# EAGLE design Spypow (EAGLE 5.11)
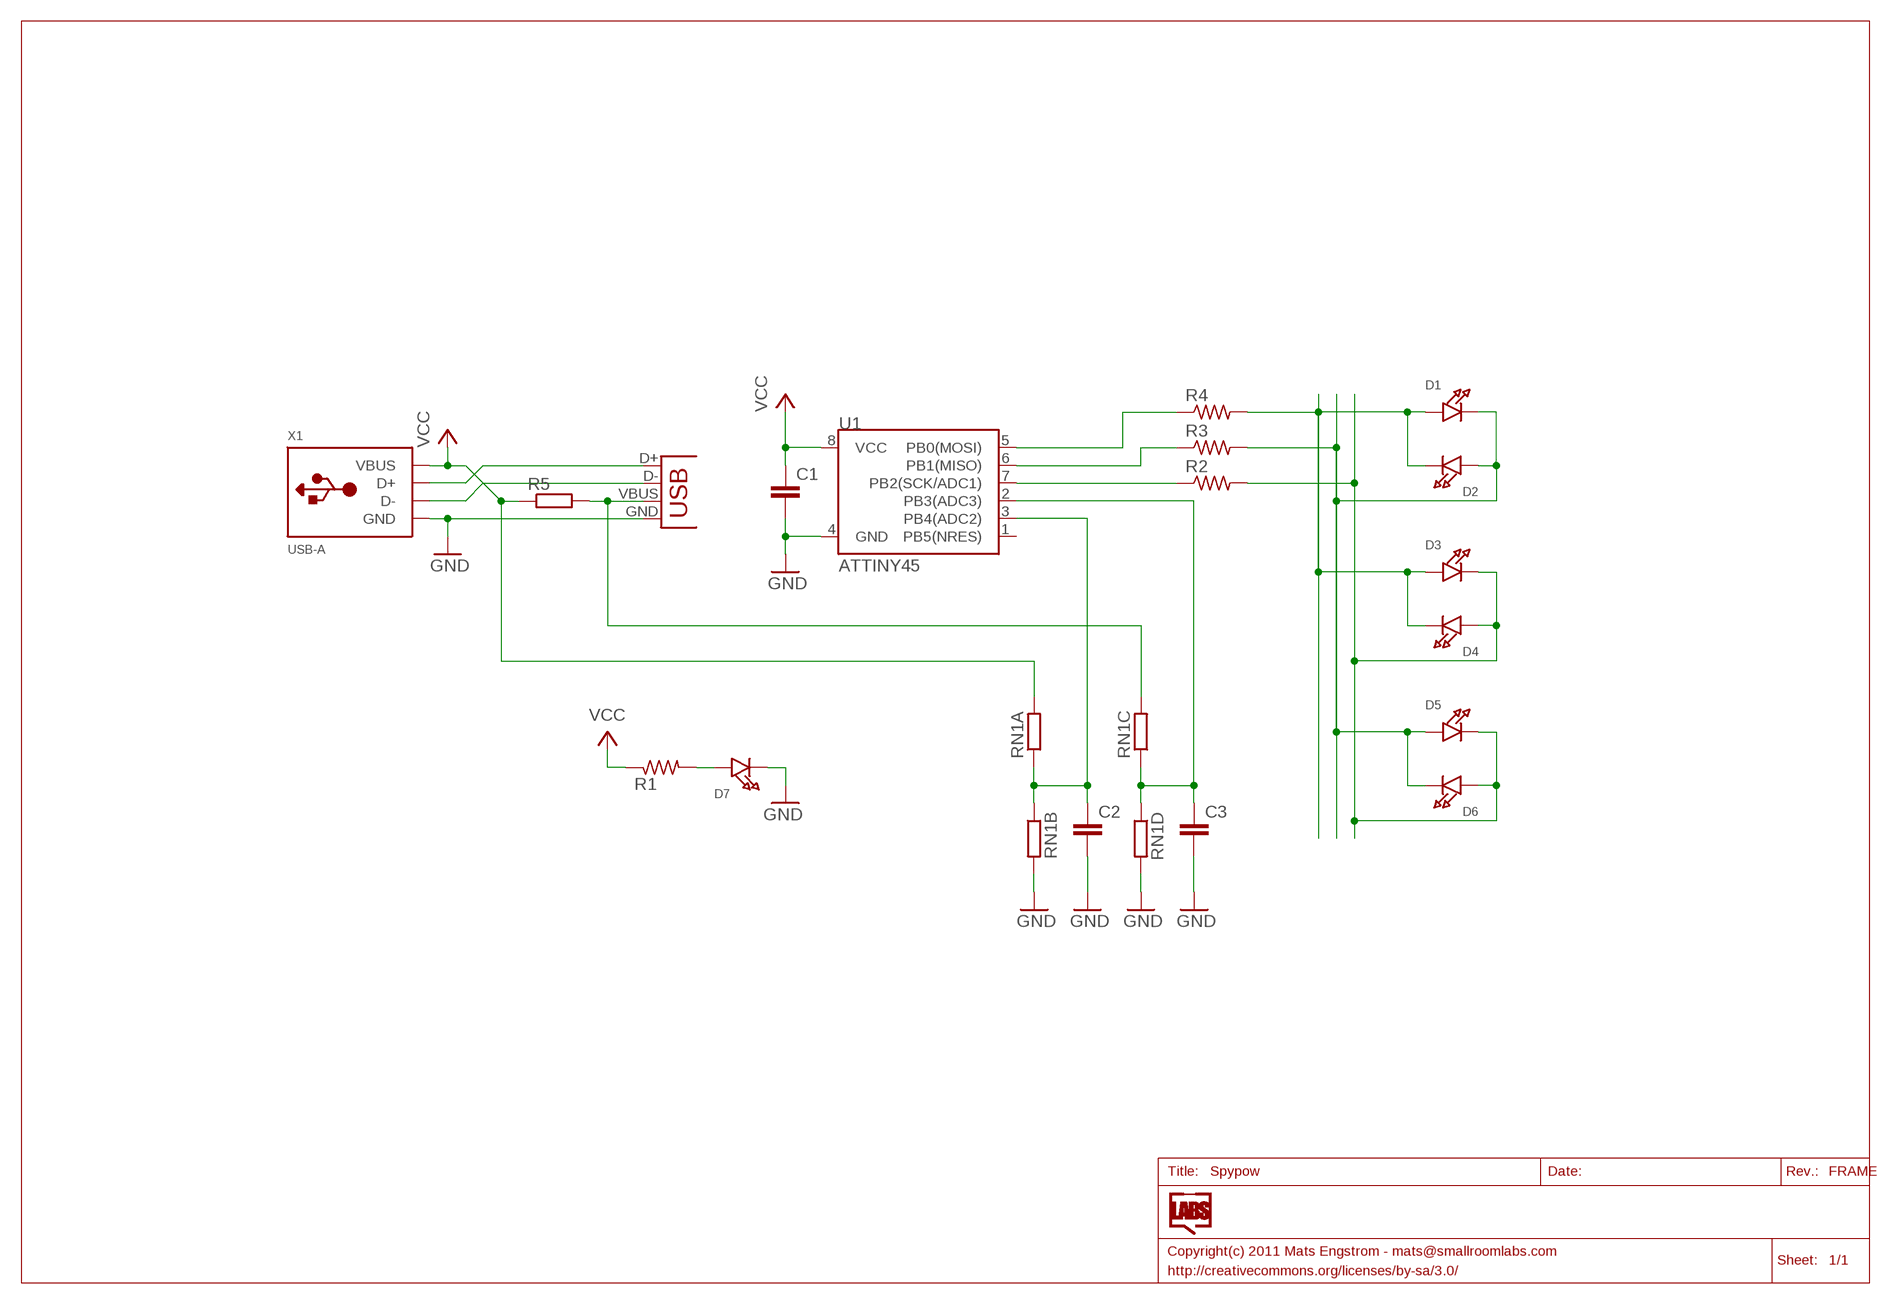
[diagram p0: schematic, sheet 1]

## Parts
C1  C-EUC0805K  [C0805K]
C2  C-EUC0805K  [C0805K]
C3  C-EUC0805K  [C0805K]
D1  LEDSMD0805  [CHIPLED_0805]
D2  LEDSMD0805  [CHIPLED_0805]
D3  LEDSMD0805  [CHIPLED_0805]
D4  LEDSMD0805  [CHIPLED_0805]
D5  LEDSMD0805  [CHIPLED_0805]
D6  LEDSMD0805  [CHIPLED_0805]
D7  LEDSMD0805  [CHIPLED_0805]
R1  RES0805A  [R0805A]
R2  RES0805A  [R0805A]
R3  RES0805A  [R0805A]
R4  RES0805A  [R0805A]
R5  R-EU_M1206  [M1206]
RN1  RESISTOR_ARRAY_4  [RN8P-4R-CRA06S]
U1  ATTINY45  [SO08-EIAJ]
X1  USB-A  [MOLEX_480371000]
X2  USBUSB-A-S-NOSILK  [USB-A-S-NOSILK]

## Nets
GND: C1.2 C2.2 C3.2 D7.C RN1.5 RN1.7 U1.4(GND) X1.4(GND) X2.GND
N$1: R5.2 RN1.6 X2.VBUS
N$2: R4.1 U1.5(PB0(MOSI))
N$3: X1.2(D-) X2.D-
N$4: X1.3(D+) X2.D+
N$5: D7.A R1.2
N$6: R3.1 U1.6(PB1(MISO))
N$7: R2.1 U1.7(PB2(SCK/ADC1))
N$9: D1.A D2.C D3.A D4.C R4.2
N$11: D1.C D2.A D5.A D6.C R3.2
N$12: D3.C D4.A D5.C D6.A R2.2
N$13: C2.1 RN1.1 RN1.2 U1.3(PB4(ADC2))
N$14: C3.1 RN1.3 RN1.4 U1.2(PB3(ADC3))
VCC: C1.1 R1.1 R5.1 RN1.8 U1.8(VCC) X1.1(VBUS)
Unconnected: U1.1(PB5(NRES))

## Library data of the parts
C1-C3 = rcl:C-EU: CAPACITOR, European symbol
D1-D7 = SmallRoomLabs:LED
R1-R4 = SmallRoomLabs:RES
R5 = rcl:R-EU_: RESISTOR, European symbol
RN1 = dp_devices:RESISTOR_ARRAY_4: 4 Resistor Array 0603
U1 = SparkFun:ATTINY45: Atmel ATTiny45
X1 = adafruit:USB-A: USB type A 'plug' Used for things that can directly connect to a USB port, say USB key
X2 = SparkFun:USB: USB Connectors USB-B-PTH is fully proven SKU : PRT-00139 USB-miniB is fully proven SKU : PRT-00587 USB-A-PCB is untested. USB-A-H is throughly reviewed, but untested. Spark Fun Electronics SKU : PRT-00437 USB-B-SMT is throughly reviewed, but untested. Needs silkscreen touching up. USB-A-S has not been used/tested USB-MB-H has not been used/tested

## Net classes
0 default: width 0.203 mm, drill 0.305 mm, clearance 0.203 mm

## Board
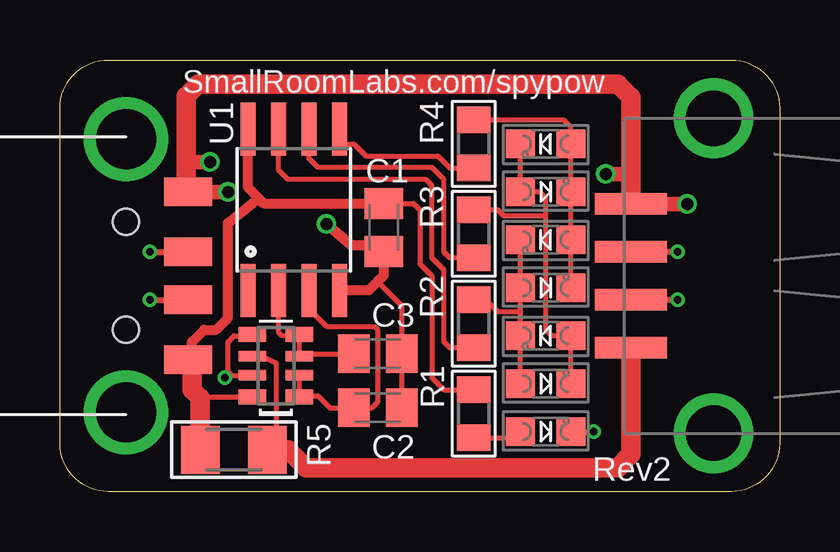
[diagram p1: board, top side]
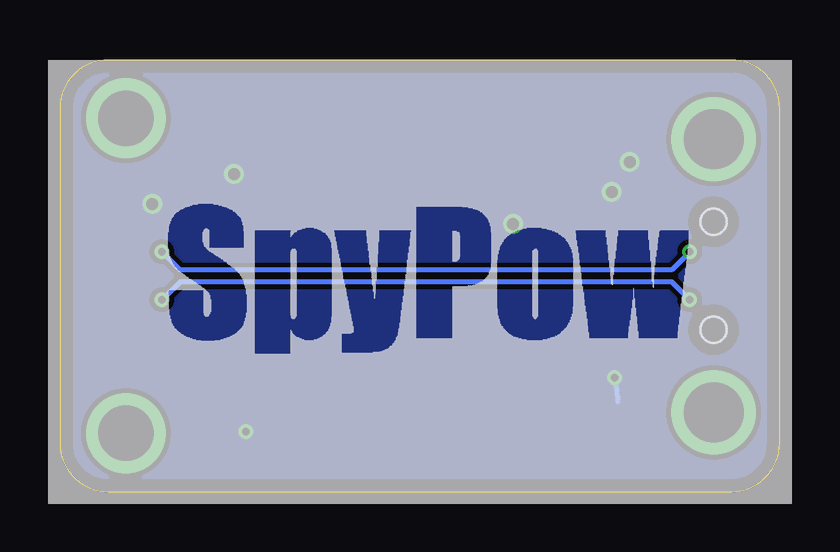
[diagram p2: board, bottom side, seen from below]

Size 30 x 18 mm. Coordinates in mm from the lower left corner, seen from the top.
Outline: 0,16 arc-90 2,18 28,18 arc-90 30,16 30,2 arc-90 28,0 2,0 arc-90 0,2 0,16
Copper layers (1*16): Top 0.035mm / dielectric 1.5mm / Bottom 0.035mm
Design rules "SmartPrototyping": minimum track width 7mil, minimum drill 12mil, track to track 7mil, track to pad 7mil, pad to pad 7mil, via to via 7mil, smd to smd 0mil, copper to edge 20mil, drill to drill 10mil, minimum pad ring 10mil, minimum via ring 6mil, stop-mask expansion 2mil, vias tented up to drill 25mil, thermal gap 10mil

### Footprints (pad centres in the part's own frame; a part is rotated, then mirrored left to right if it is on the bottom)
C0805K = smd 1.3 x 1.6: 1 -1,0; 2 1,0
CHIPLED_0805 = smd 1.2 x 1.2: A 0,-1.05; C 0,1.05
R0805A = smd 1.1 x 1.4: 1 -1,0; 2 1,0
M1206 = smd 1.6 x 2: 1 -1.4,0; 2 1.4,0
RN8P-4R-CRA06S = smd 0.63 x 1.15: 1 -1.295,-0.975; 4 1.295,-0.975; 5 1.295,0.975; 8 -1.295,0.975 | smd 0.44 x 1.15: 2 -0.4,-0.975; 3 0.4,-0.975; 6 0.4,0.975; 7 -0.4,0.975
SO08-EIAJ = smd 0.61 x 2.21: 1 -1.905,-3.378; 2 -0.635,-3.378; 3 0.635,-3.378; 4 1.905,-3.378; 5 1.905,3.353; 6 0.635,3.353; 7 -0.635,3.353; 8 -1.905,3.353
MOLEX_480371000 = smd 1.2 x 2: 1 3.5,2.6; 2 1,2.6; 3 -1,2.6; 4 -3.5,2.6 | drill 2.5 round: M1 -5.7,0; M2 5.7,0 | hole 1.1: -2.25,0; 2.25,0
USB-A-S-NOSILK = smd 3 x 0.9: D+ 3.45,-1; D- 3.45,1; GND 3.45,-3; VBUS 3.45,3 | drill 2.311 round: P$5 0,-6.566; P$6 0,6.566

### Placement (x,y rotation side)
C1  13.5,11.02 270 top
C2  13.25,3.5 0 top
C3  13.25,5.75 0 top
D1  20.25,14.5 90 top
D2  20.25,12.5 270 top
D3  20.25,10.5 90 top
D4  20.25,8.5 270 top
D5  20.25,6.5 90 top
D6  20.25,4.5 270 top
D7  20.25,2.5 270 top
R1  17.25,3.25 270 top
R2  17.25,7 90 top
R3  17.25,10.75 90 top
R4  17.25,14.5 90 top
R5  7.25,1.75 0 top
RN1  9,5.25 90 top
U1  9.75,11.77 0 top
X1  2.75,9 270 top
X2  27.25,9 180 top

### Tracks (layer width: path | path; a pad name or v marks a point on that pad's centre or on a via)
GND  (via drill 0.3, 0.5)
  Top 0.203: C2.2 C3.2 14.25,7.75 13.24,8.76 | 7.15,4.85 RN1.7 | 7.15,4.85 7,5 7,6.25 7.25,6.5 7.73,6.5 RN1.5 | v6.88,4.75 7.15,4.85
  Top 0.254: D7.C v22.25,2.5
  Top 0.406: U1.4 12.87,8.39 13.24,8.76 13.5,9.02 C1.2 13.25,10.27 12.15,10.27 v11.11,11.17
  Top 0.61: 5.25,12.6 X1.4 v7,12.5 | 23.8,13.25 v22.75,13.25 | 5.25,13.75 v6.25,13.75 | X2.GND v26.15,12
  Top 0.813: X2.GND 23.8,13.25 23.8,16.45 23.25,17 5.75,17 5.25,16.5 5.25,13.75 5.25,12.6
  Bottom 0.203: v6.88,4.75 6.75,3.75
  pour Bottom: 0,18 30,18 30,0 0,0
N$1
  Top 0.203: RN1.6 8.35,5.65 9.03,5.35 9.03,2.12 R5.2
  Top 0.813: X2.VBUS 23.8,1.55 23.25,1 10.25,1 9.5,1.75 R5.2
N$2
  Top 0.203: R4.1 16.25,13.5 15.75,14 12.75,14 12.25,14.5 11.75,14.5 11.75,15.02 U1.5
N$3  (via drill 0.3)
  Top 0.254: v25.75,8 X2.D- | v3.75,8 X1.2
  Bottom 0.203: v3.75,8 4.5,8.75 25,8.75 v25.75,8
N$4  (via drill 0.3)
  Top 0.254: v25.75,10 X2.D+ | v3.75,10 X1.3
  Bottom 0.203: v3.75,10 4.5,9.25 25,9.25 v25.75,10
N$5
  Top 0.203: R1.2 18.95,2.25 D7.A
N$6
  Top 0.203: U1.6 10.38,13.88 10.75,13.52 15.5,13.52 16,13.02 16,10 16.25,9.75 R3.1
N$7
  Top 0.203: U1.7 9.12,13.4 9.5,13.02 15.25,13.02 15.5,12.77 15.5,9.75 16,9.25 16,6.25 16.25,6 R2.1
N$9
  Top 0.203: D4.C D3.A D2.C D1.A 21.3,15.2 21,15.5 R4.2
N$11
  Top 0.203: D1.C D2.A 20,12.5 20.25,12.25 20.25,11.5 | D6.C D5.A 20.5,6.5 20.25,6.75 20.25,11.5 | R3.2 18.25,11.75 18.5,11.5 20.25,11.5
  Top 0.254: D6.C 21.25,4.45
N$12
  Top 0.203: D6.A D5.C 19.2,7.5 | D3.C D4.A 19.2,7.5 | R2.2 17.75,8 18.25,7.5 19.2,7.5
N$13
  Top 0.203: RN1.2 RN1.1 9.77,4 10.75,4 11.25,3.5 C2.1 13,3.5 13.25,3.75 13.25,6.75 13.12,6.88 11.12,6.88 10.38,7.62 U1.3
N$14
  Top 0.203: C3.1 9.82,5.75 RN1.3 RN1.4 9.93,6.5 9.25,6.5 9.12,6.63 U1.2
VCC
  Top 0.203: R1.1 16,4.25 15.5,4.75 15.5,9 15,9.5 15,11.75 14.73,12.02 C1.1 | RN1.8 5.91,3.96 5.85,3.9
  Top 0.406: U1.8 7.84,12.67 8.5,12.02 | 8.5,12.02 C1.1 | 8.5,12.02 8.25,12.22 7,11.2 7,7.25 6.5,6.75 6,6.75 5.5,6.25 5.5,5.65 X1.1
  Top 0.813: R5.1 5.85,3.9 5.5,4.25 5.5,5.35 X1.1

### Text on the board
tPlace: SmallRoomLabs.com/spypow | Rev2